# Altium schematic sheet eth_usb.SchDoc
size A3
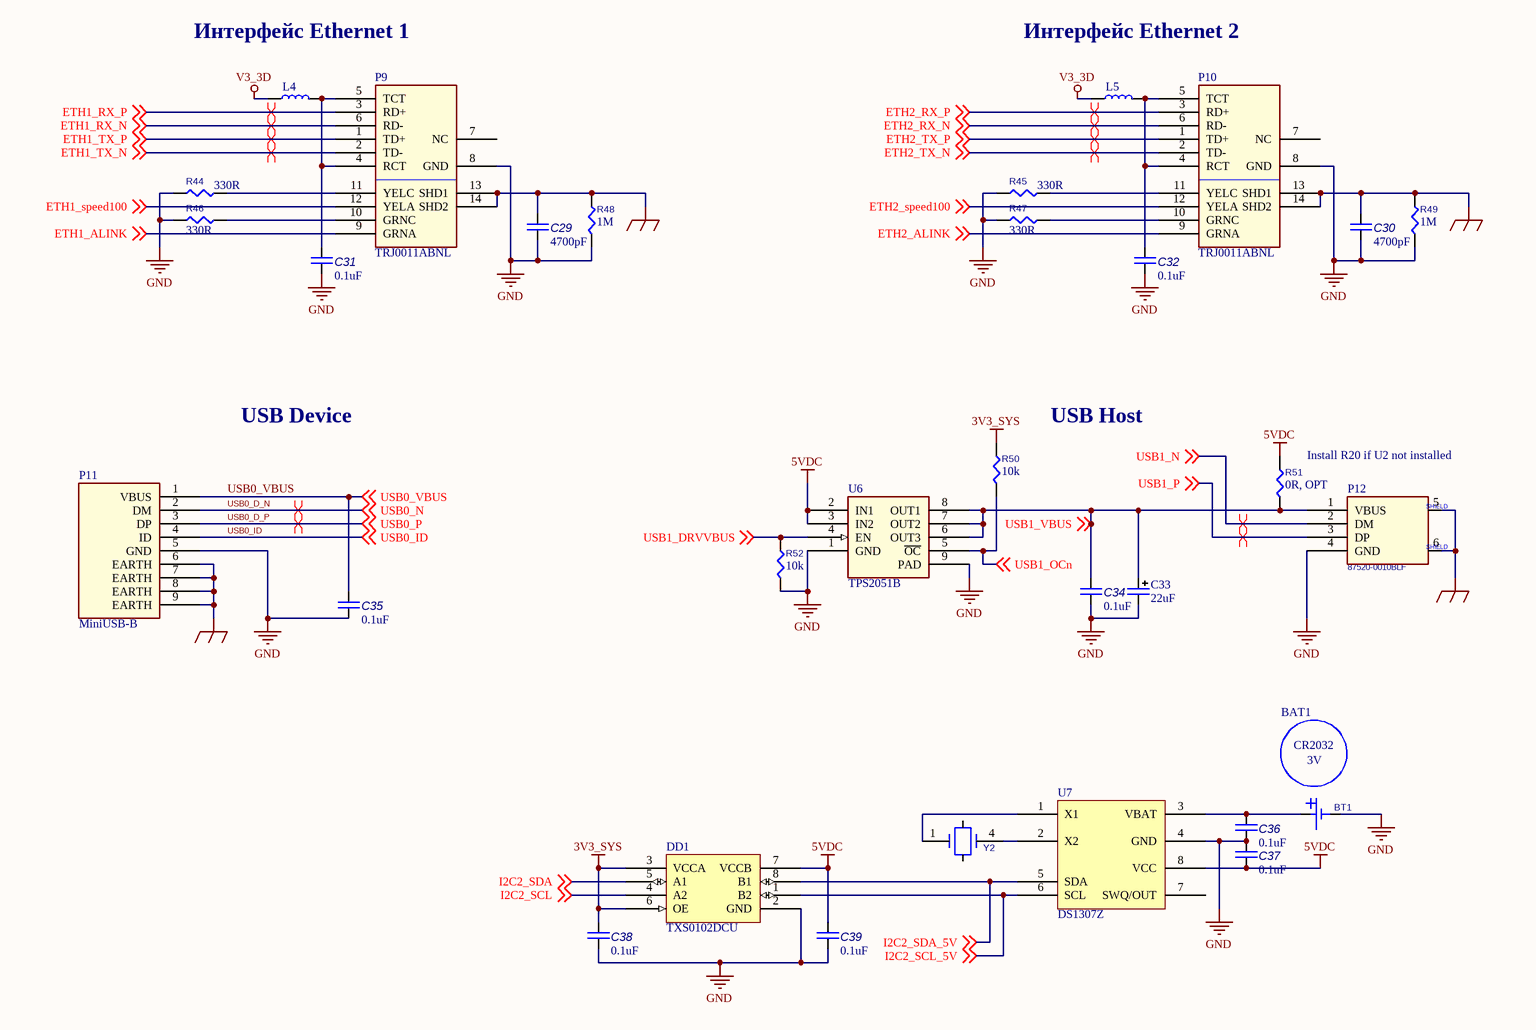
[diagram p0: eth_usb.SchDoc]

## Parts
BAT1  CR2032-BAT  (value not drawn)
BT1  CR2032  [BH2032CH25]  (value not drawn)
C29  value 4700pF  [CC1608-0603]  (hidden comment: C0603)
C30  value 4700pF  [CC1608-0603]  (hidden comment: C0603)
C31  value 0.1uF  [CC1608-0603]  (hidden comment: C0603)
C32  value 0.1uF  [CC1608-0603]  (hidden comment: C0603)
C33  value 22uF  [CAP_B]  (hidden comment: *)
C34  value 0.1uF  [CC1608-0603]  (hidden comment: C0603)
C35  value 0.1uF  [CC1608-0603]  (hidden comment: C0603)
C36  value 0.1uF  [CC1608-0603]  (hidden comment: C0603)
C37  value 0.1uF  [CC1608-0603]  (hidden comment: C0603)
C38  value 0.1uF  [CC1608-0603]  (hidden comment: C0603)
C39  value 0.1uF  [CC1608-0603]  (hidden comment: C0603)
DD1  TXS0102DCU  [SOP127P600-8N]
L4  BLM18A-FB  [CHIP0603]  (value not drawn)
L5  BLM18A-FB  [CHIP0603]  (value not drawn)
P9  CONN_RJ45_MAG_WE_0  [TRJ0011ABNL]  (value not drawn)
P10  CONN_RJ45_MAG_WE_0  [TRJ0011ABNL]  (value not drawn)
P11  MiniUSB-B  [MINI-USB-B5 SMT]
P12  P/N: 87520-0010BLF  [USB2.5-2H4C]  (hidden comment: CONN_54819-0578_2)
R44  value 330R  [RESC1608X55N]  (hidden comment: R0603)
R45  value 330R  [RESC1608X55N]  (hidden comment: R0603)
R46  value 330R  [RESC1608X55N]  (hidden comment: R0603)
R47  value 330R  [RESC1608X55N]  (hidden comment: R0603)
R48  value 1M  [RESC1608X55N]  (hidden comment: R0603)
R49  value 1M  [RESC1608X55N]  (hidden comment: R0603)
R50  value 10k  [RESC1608X55N]  (hidden comment: R0603)
R51  value 0R, OPT  [RESC1608X55N]  (hidden comment: R0603)
R52  value 10k  [RESC1608X55N]  (hidden comment: R0603)
U6  TPS2051B  [R-PDSO-G8]
U7  DS1307Z  [SOIC127P600X175-8N]
Y2  KX-327S  [ABS25-32.768KHZ-T]  (value not drawn)

## Nets
3V3_SYS: C38.1 DD1.3(VCCA) DD1.6(OE) R50.2
5VDC: C37.2 C39.1 DD1.7(VCCB) R51.2 U6.2(IN1) U6.3(IN2) U7.8(VCC)
EARTH: C29.1 C30.1 P9.13(SHD1) P9.14(SHD2) P10.13(SHD1) P10.14(SHD2) P11.6(EARTH) P11.7(EARTH) P11.8(EARTH) P11.9(EARTH) P12.5(SHELD1) P12.6(PAD4) R48.2 R49.2
GND: BT1.2 C29.2 C30.2 C31.2 C32.2 C33.2 C34.1 C35.2 C36.2 C37.1 C38.2 C39.2 DD1.2(GND) P9.8(GND) P10.8(GND) P11.5(GND) P12.4(GND) R44.1 R45.1 R46.1 R47.1 R48.1 R49.1 R52.1 U6.1(GND) U6.9(PAD) U7.4(GND)
V3_3D: L4.1 L5.1
ETH1_ALINK: P9.9(GRNA) ; off-sheet ETH1_ALINK
ETH1_RX_N: P9.6(RD-) ; off-sheet ETH1_RX_N
ETH1_RX_P: P9.3(RD+) ; off-sheet ETH1_RX_P
ETH1_speed100: P9.12(YELA) ; off-sheet ETH1_speed100
ETH1_TX_N: P9.2(TD-) ; off-sheet ETH1_TX_N
ETH1_TX_P: P9.1(TD+) ; off-sheet ETH1_TX_P
ETH2_ALINK: P10.9(GRNA) ; off-sheet ETH2_ALINK
ETH2_RX_N: P10.6(RD-) ; off-sheet ETH2_RX_N
ETH2_RX_P: P10.3(RD+) ; off-sheet ETH2_RX_P
ETH2_speed100: P10.12(YELA) ; off-sheet ETH2_speed100
ETH2_TX_N: P10.2(TD-) ; off-sheet ETH2_TX_N
ETH2_TX_P: P10.1(TD+) ; off-sheet ETH2_TX_P
I2C2_SCL: DD1.4(A2) ; off-sheet I2C2_SCL
I2C2_SCL_5V: DD1.1(B2) U7.6(SCL) ; off-sheet I2C2_SCL_5V
I2C2_SDA: DD1.5(A1) ; off-sheet I2C2_SDA
I2C2_SDA_5V: DD1.8(B1) U7.5(SDA) ; off-sheet I2C2_SDA_5V
USB0_D_N: P11.2(DM) ; off-sheet USB0_N  [also labelled USB0_N]
USB0_D_P: P11.3(DP) ; off-sheet USB0_P  [also labelled USB0_P]
USB0_ID: P11.4(ID) ; off-sheet USB0_ID
USB0_VBUS: C35.1 P11.1(VBUS) ; off-sheet USB0_VBUS
USB1_DRVVBUS: R52.2 U6.4(EN) ; off-sheet USB1_DRVVBUS
USB1_N: P12.2(DM) ; off-sheet USB1_N
USB1_OCn: R50.1 U6.5(~{OC}) ; off-sheet USB1_OCn
USB1_P: P12.3(DP) ; off-sheet USB1_P
USB1_VBUS: C33.1 C34.2 P12.1(VBUS) R51.1 U6.6(OUT3) U6.7(OUT2) U6.8(OUT1) ; off-sheet USB1_VBUS
NetBT1_1: BT1.1 C36.1 U7.3(VBAT)
NetC31_1: C31.1 L4.2 P9.4(RCT) P9.5(TCT)
NetC32_1: C32.1 L5.2 P10.4(RCT) P10.5(TCT)
NetP9_10: P9.10(GRNC) R46.2
NetP9_11: P9.11(YELC) R44.2
NetP10_10: P10.10(GRNC) R47.2
NetP10_11: P10.11(YELC) R45.2
NetU7_1: U7.1(X1) Y2.1
NetU7_2: U7.2(X2) Y2.4

Not connected (* = marked no-connect by the designer): P9 7(NC); P10 7(NC); U7 7(SWQ/OUT); Y2 2 3

## Layout directives
differential pair: ETH1_RX_N, ETH1_RX_P, ETH1_TX_N, ETH1_TX_P, ETH2_RX_N, ETH2_RX_P, ETH2_TX_N, ETH2_TX_P, USB0_D_N, USB0_D_P, USB1_N, USB1_P

## Notes on the sheet
- Интерфейс Ethernet 1
- Интерфейс Ethernet 2
- USB Device
- USB Host
- (near R51) Install R20 if U2 not installed
- (in symbol CONN_54819-0578_2) SHIELD
- (in symbol CR2032-BAT) 3V

## Library data of the parts
BAT1 = CR2032-BAT: Battery CR2032; P/N: CR2032
BT1 = CR2032: CR2032 battery holder; P/N: CH25-2032
C33 = Cap_B: Tantalum Capacitor Case D; P/N: *
DD1 = TXS0102DCU: 2bit Bidirectional voltage translator; Manufacturer: TI; Package: DCU; P/N: TXS0102DCU
L4 L5 = BLM18A-FB: Chip EMIFILr Inductor Type; Manufacturer: Murata; P/N: BLM18AG601SN1D
P9 P10 = CONN_RJ45_MAG_WE_0: RJ-45 10/100 W/Magnetics; Mfr: Link PP; P/N-2: Wurth 7499011212; P/N: TRJ0011ABNL
P11 = MiniUSB-B: Mini USB Type B CONNECTOR; Mfr: Hirose; P/N: UX60SC-MB-5ST(80)
P12 = CONN_54819-0578_2: USB Type A Connectors; Mfr: FCI
U6 = TPS2051B: CURRENT-LIMITED, POWER-DISTRIBUTION SWITCHES; Mfr: TI; P/N: TPS2051BDGN
U7 = DS1307Z: I2C Real-Time Clock; Manufacturer: Maxim/Dallas; P/N: DS1307ZN+T&R
Y2 = KX-327S: CRYSTAL 32.768KHZ 12.5PF SMD; Mfr: Abracon; P/N: ABS25-32.768KHZ-T
C29-C32 C34-C39 = C0603: P/N: *
R44-R52 = R0603: P/N: *